# Altium schematic sheet PWU.SchDoc
size A; SheetNumber: 4; SheetTotal: 5
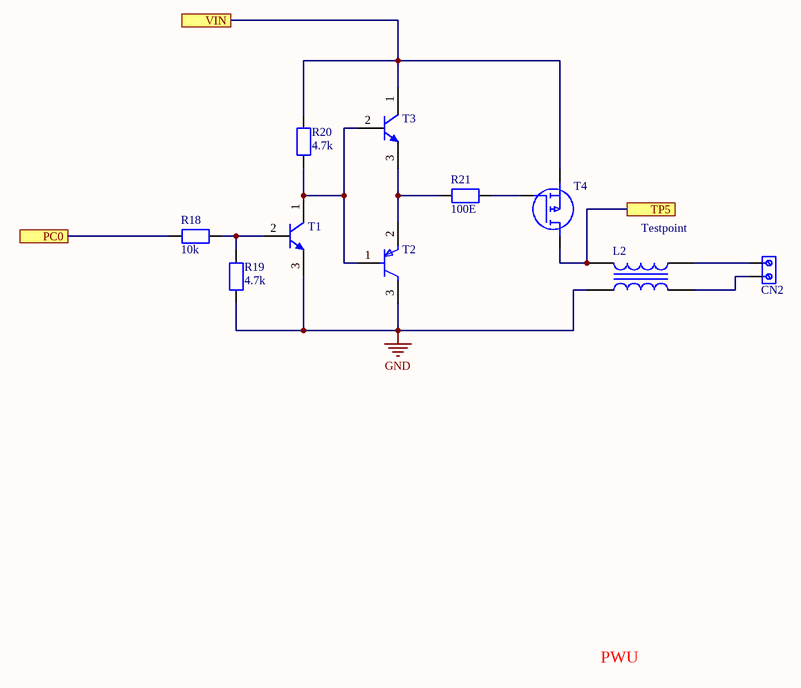
[diagram p0: PWU.SchDoc]

## Parts
CN2  connecters 2pins  [conncecto 2 pins]  (value not drawn)
L2  CM2545X171R-10  [LIRD-CM2545X171R-10_V]  (value not drawn)
R18  10k  [RES_0805]
R19  4.7k  [RES_0805]
R20  4.7k  [RES_0805]
R21  100E  [RES_0805]
T1  BC547CG  [ONSC-TO-92-3-29-11]  (value not drawn)
T2  BCV26  [FP-318-IPC_C]  (value not drawn)
T3  BC547CG  [ONSC-TO-92-3-29-11]  (value not drawn)
T4  Mosfet  [TO254P469X1042X1967-3P]  (value not drawn)

## Ports
PC0 (see CPU[4C]), TP5, VIN (see PowerSupply[3C])

## Nets
GND: L2.2 R19.1 T1.3(E) T2.3(C)
PC0: R18.1 ; port PC0
TP5: L2.1 T4.3(D) ; port TP5
VIN: R20.2 T3.1(C) T4.2(S) ; port VIN
NetCN2_1: CN2.1 L2.4
NetCN2_2: CN2.2 L2.3
NetR18_2: R18.2 R19.2 T1.2(B)
NetR20_1: R20.1 T1.1(C) T2.1(B) T3.2(B)
NetR21_1: R21.1 T2.2(E) T3.3(E)
NetR21_2: R21.2 T4.1(G)

## Notes on the sheet
- (near L2) Testpoint
- PWU

## Library data of the parts
CN2 = pins: printkroonsteen 5,08 mm,
L2 = CM2545X171R-10: Data Line Filter, 2 Function(s), 10A, 4 Pin(s); Manufacturer: Laird; DC Resistance-Max: 10mR; Channels: 2; Output Impedance: 170R; Supplier: Avnet; Supplier Part Number: CM2545X171R-10; Manufacturer Part Number: CM2545X171R-10; RoHS: Yes; Category: Common Mode Chokes; Stock: 12000; Pricing: 400=1.14668, 800=1.12312, 1600=1.09956, 2400=1.076, 3200=1.05244, 4000=1.02887, 40000=0.70911 (USD); Mounting Technology: Surface Mount; Terminal Finish: Nickel; Filter Type: DATA LINE FILTER; Current Rating: 10A; JESD-609 Code: e3; Length: 11.38mm; Width: 6.3mm; Height: 9.32mm; RoHS Compliant: Yes; Reach SVHC Compliant: Yes; ComponentLink1URL: https://datasheet.ciiva.com:443/pdfs/VipMasterIC/IC/LATE/LATES02109/LATES02109-1.pdf?src-supplier=IHS+Markit; ComponentLink1Description: https://datasheet.ciiva.com:443/pdfs/VipMasterIC/IC/LATE/LATES02109/LATES02109-1.pdf?src-supplier=IHS+Markit
R18-R21 = RES_0805: SMD size 0805 Generic.; Manufacturer: *; Manufacture Part N: *; Tolerence: *; Package Size: *; Voltage Rating: *
T1 T3 = BC547CG: Small Signal Bipolar Transistor, 0.1A I(C), 45V V(BR)CEO, 1-Element, NPN, Silicon, TO-92; Manufacturer: ON Semiconductor; Package Body Material: Plastic; Max Collector Current: 100mA; DC Current Gain-Min (hFE): 420; Number of Elements: 1; Power Dissipation-Max (Abs): 625mW; Surface Mount: No; Time @ Peak Reflow Temperature-Max (s): 40s; Transistor Application: AMPLIFIER; Frequency: 300MHz; Qualification Status: Not Qualified; Supplier: Arrow Electronics; Supplier Part Number: BC547CG; Manufacturer Part Number: BC547CG; RoHS: Yes; Category: BJTs; Stock: 41483; Pricing: 1=0.214, 25=0.189, 100=0.169, 500=0.16, 1000=0.107, 2500=0.092, 5000=0.08, 10000=0.064, 25000=0.062 (USD); Pins: 3; Package Shape: Round; Terminal Finish: Copper; Transistor Element Material: SILICON; Max Operating Temperature: 150°C; JESD-609 Code: e1; Polarity/Channel Type: NPN; Collector-emitter Voltage-Max: 45V; JESD-30 Code: O-PBCY-T3; Package Style: CYLINDRICALMeter; Peak Reflow Temperature (Cel): 260°C; Terminal Form: Through Hole; Terminal Position: BOTTOM; RoHS Compliant: Yes; Reach SVHC Compliant: Yes; JEDEC-95 Code: TO-92; ComponentLink1URL: https://datasheet.ciiva.com:443/pdfs/VipMasterIC/IC/ONSM/ONSMS24464/ONSMS24464-1.pdf?src-supplier=IHS+Markit; ComponentLink1Description: https://datasheet.ciiva.com:443/pdfs/VipMasterIC/IC/ONSM/ONSMS24464/ONSMS24464-1.pdf?src-supplier=IHS+Markit; ComponentLink2URL: https://datasheet.ciiva.com/977/bc546-d-977051.pdf?src-supplier=Digikey; ComponentLink2Description: https://datasheet.ciiva.com/977/bc546-d-977051.pdf?src-supplier=Digikey
T2 = BCV26: Small Signal Bipolar Transistor, 1.2A I(C), 30V V(BR)CEO, 1-Element, PNP, Silicon; Manufacturer: ON Semiconductor / Fairchild; Package Body Material: Plastic; DC Current Gain-Min (hFE): 20000; Number of Elements: 1; Power Dissipation-Max (Abs): 300mW; Frequency: 220MHz; Qualification Status: Not Qualified; Supplier: Future Electronics; Supplier Part Number: 8096588; Manufacturer Part Number: BCV26; RoHS: Yes; Category: BJTs; Stock: 27000; Pricing: 3000=0.0435, 9000=0.0419, 15000=0.0412, 60000=0.0393, 90000=0.0381 (USD); Pins: 3; Package Shape: Rectangular; Transistor Element Material: SILICON; Max Operating Temperature: 150°C; Polarity/Channel Type: PNP; Max Collector Current: 1.2A; Collector-emitter Voltage-Max: 30V; JESD-30 Code: R-PDSO-G3; Package Style: SMALL OUTLINEMeter; Surface Mount: Yes; Terminal Form: Gull Wing; Terminal Position: DUAL; Moisture Sensitivity Level: 1; Reach SVHC Compliant: Yes; RoHS Compliant: Yes; ComponentLink1URL: https://datasheet.ciiva.com:443/pdfs/VipMasterIC/IC/ONSM/ONSM-S-A0003590120/ONSM-S-A0003585143-1.pdf?src-supplier=IHS+Markit; ComponentLink1Description: https://datasheet.ciiva.com:443/pdfs/VipMasterIC/IC/ONSM/ONSM-S-A0003590120/ONSM-S-A0003585143-1.pdf?src-supplier=IHS+Markit; ComponentLink2URL: https://datasheet.ciiva.com/5770/276230-5770438.pdf?src-supplier=Avnet; ComponentLink2Description: https://datasheet.ciiva.com/5770/276230-5770438.pdf?src-supplier=Avnet; ComponentLink3URL: https://datasheet.ciiva.com/5770/276230-5770438.pdf?src-supplier=Farnell; ComponentLink3Description: https://datasheet.ciiva.com/5770/276230-5770438.pdf?src-supplier=Farnell; ComponentLink4URL: https://datasheet.ciiva.com/4458/bcv26-104632-4458944.pdf?src-supplier=Mouser; ComponentLink4Description: https://datasheet.ciiva.com/4458/bcv26-104632-4458944.pdf?src-supplier=Mouser; ComponentLink5URL: https://datasheet.ciiva.com/7972/276230-7972620.pdf?src-supplier=Element14; ComponentLink5Description: https://datasheet.ciiva.com/7972/276230-7972620.pdf?src-supplier=Element14; ComponentLink6URL: https://datasheet.ciiva.com/7972/276230-7972621.pdf?src-supplier=Element14; ComponentLink6Description: https://datasheet.ciiva.com/7972/276230-7972621.pdf?src-supplier=Element14; ComponentLink7URL: https://datasheet.ciiva.com/6360/bcv26-6360908.pdf?src-supplier=Digikey; ComponentLink7Description: https://datasheet.ciiva.com/6360/bcv26-6360908.pdf?src-supplier=Digikey; ComponentLink8URL: https://datasheet.ciiva.com/6360/bcv26-6360909.pdf?src-supplier=Digikey; ComponentLink8Description: https://datasheet.ciiva.com/6360/bcv26-6360909.pdf?src-supplier=Digikey; ComponentLink9URL: https://datasheet.ciiva.com/6360/bcv26-6360911.pdf?src-supplier=Digikey; ComponentLink9Description: https://datasheet.ciiva.com/6360/bcv26-6360911.pdf?src-supplier=Digikey
T4 = Mosfet: Mosfet Transistor, IRF9Z34NPBF, generic.